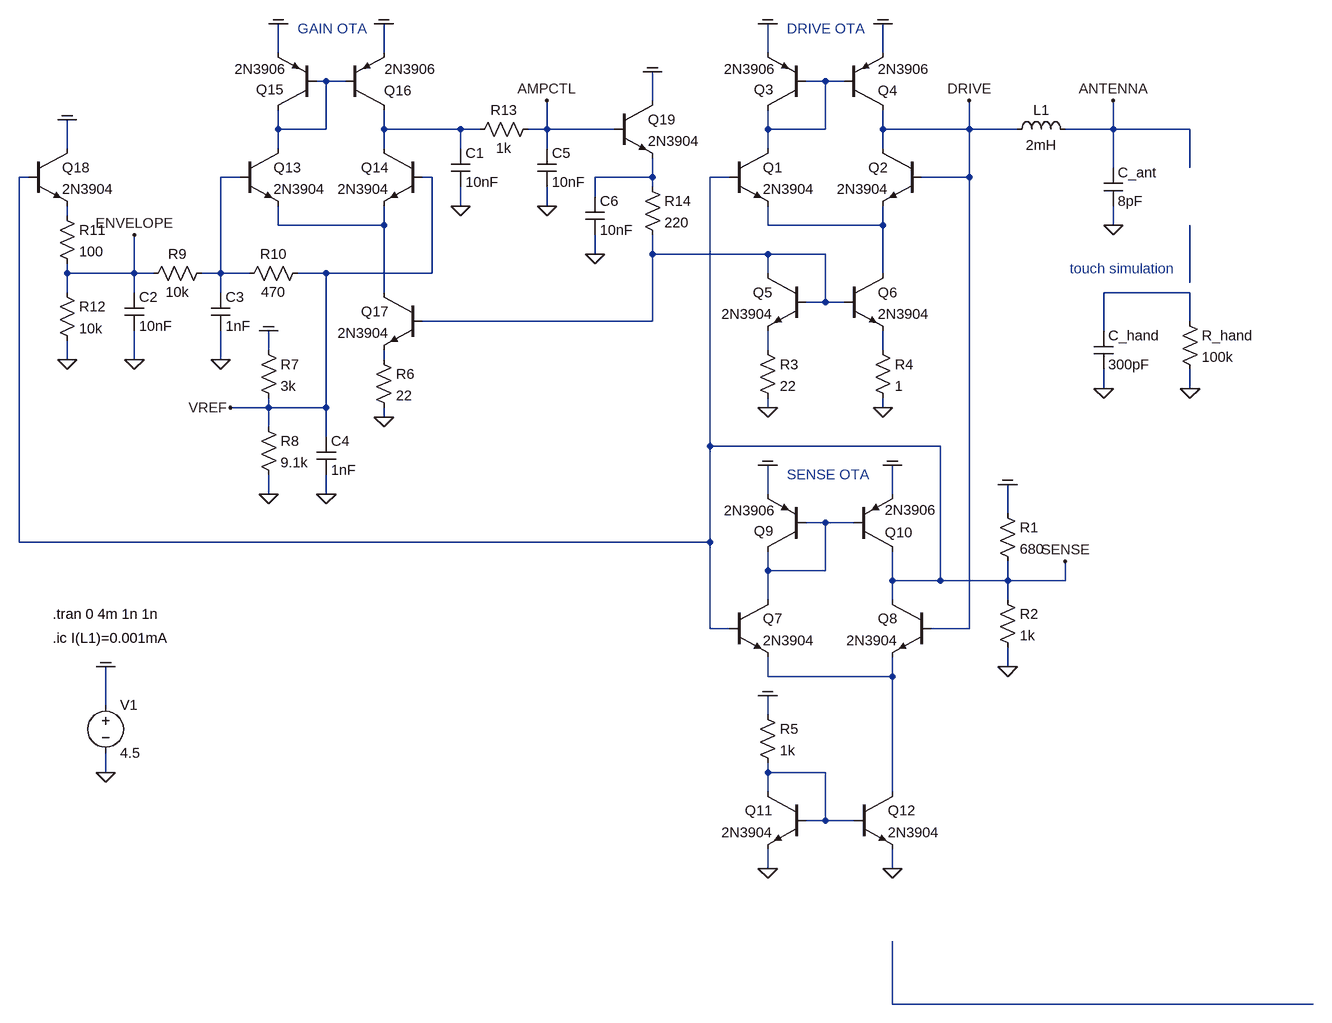
[diagram p0: schematic bjt_current_sensing_oscillator_ota_v10.asc]
bjt_current_sensing_oscillator_ota_v10.asc, the LTspice schematic file:
Version 4
SHEET 1 4648 6228
WIRE 48 1552 48 1504
WIRE 224 1552 224 1504
WIRE 864 1552 864 1504
WIRE 1056 1552 1056 1504
WIRE 128 1600 112 1600
WIRE 160 1600 128 1600
WIRE 960 1600 928 1600
WIRE 992 1600 960 1600
WIRE 672 1632 672 1584
WIRE 48 1680 48 1648
WIRE 128 1680 128 1600
WIRE 128 1680 48 1680
WIRE 224 1680 224 1648
WIRE 352 1680 224 1680
WIRE 384 1680 352 1680
WIRE 496 1680 496 1632
WIRE 496 1680 464 1680
WIRE 608 1680 496 1680
WIRE 864 1680 864 1648
WIRE 960 1680 960 1600
WIRE 960 1680 864 1680
WIRE 1056 1680 1056 1648
WIRE 1200 1680 1200 1632
WIRE 1200 1680 1056 1680
WIRE 1280 1680 1200 1680
WIRE 1440 1680 1440 1632
WIRE 1440 1680 1360 1680
WIRE 1568 1680 1440 1680
WIRE -304 1712 -304 1664
WIRE 48 1712 48 1680
WIRE 224 1712 224 1680
WIRE 352 1712 352 1680
WIRE 496 1712 496 1680
WIRE 864 1712 864 1680
WIRE 1056 1712 1056 1680
WIRE 1440 1744 1440 1680
WIRE 1568 1744 1568 1680
WIRE -368 1760 -384 1760
WIRE -16 1760 -48 1760
WIRE 304 1760 288 1760
WIRE 672 1760 672 1728
WIRE 672 1760 576 1760
WIRE 800 1760 768 1760
WIRE 1200 1760 1200 1680
WIRE 1200 1760 1120 1760
WIRE 672 1776 672 1760
WIRE 576 1792 576 1760
WIRE 352 1808 352 1776
WIRE 496 1808 496 1776
WIRE -304 1824 -304 1808
WIRE 48 1840 48 1808
WIRE 224 1840 224 1808
WIRE 224 1840 48 1840
WIRE 864 1840 864 1808
WIRE 1056 1840 1056 1808
WIRE 1056 1840 864 1840
WIRE 1440 1840 1440 1808
WIRE 576 1888 576 1856
WIRE 672 1888 672 1856
WIRE 864 1888 672 1888
WIRE 960 1888 864 1888
WIRE -304 1920 -304 1904
WIRE -192 1920 -192 1856
WIRE -192 1920 -304 1920
WIRE -160 1920 -192 1920
WIRE -48 1920 -48 1760
WIRE -48 1920 -80 1920
WIRE 0 1920 -48 1920
WIRE 128 1920 80 1920
WIRE 304 1920 304 1760
WIRE 304 1920 128 1920
WIRE 864 1920 864 1888
WIRE 1056 1920 1056 1840
WIRE 1568 1936 1568 1840
WIRE -304 1952 -304 1920
WIRE -192 1952 -192 1920
WIRE -48 1952 -48 1920
WIRE 224 1952 224 1840
WIRE 1568 1952 1424 1952
WIRE 960 1968 960 1888
WIRE 960 1968 928 1968
WIRE 992 1968 960 1968
WIRE 672 2000 672 1888
WIRE 672 2000 288 2000
WIRE 1568 2000 1568 1952
WIRE 1424 2016 1424 1952
WIRE 32 2048 32 2016
WIRE 864 2048 864 2016
WIRE 1056 2048 1056 2016
WIRE -304 2064 -304 2032
WIRE -192 2064 -192 2016
WIRE -48 2064 -48 2016
WIRE 224 2064 224 2048
WIRE 1424 2112 1424 2080
WIRE 1568 2112 1568 2080
WIRE 32 2144 32 2128
WIRE 32 2144 -32 2144
WIRE 128 2144 128 1920
WIRE 128 2144 32 2144
WIRE 864 2144 864 2128
WIRE 1056 2144 1056 2128
WIRE 224 2160 224 2144
WIRE 32 2176 32 2144
WIRE 128 2192 128 2144
WIRE 768 2208 768 1760
WIRE 1152 2208 768 2208
WIRE 32 2288 32 2256
WIRE 128 2288 128 2256
WIRE 864 2288 864 2240
WIRE 1072 2288 1072 2240
WIRE 1264 2320 1264 2272
WIRE 960 2336 928 2336
WIRE 1008 2336 960 2336
WIRE -384 2368 -384 1760
WIRE 768 2368 768 2208
WIRE 768 2368 -384 2368
WIRE 864 2416 864 2384
WIRE 960 2416 960 2336
WIRE 960 2416 864 2416
WIRE 1072 2432 1072 2384
WIRE 1152 2432 1152 2208
WIRE 1152 2432 1072 2432
WIRE 1264 2432 1264 2400
WIRE 1264 2432 1152 2432
WIRE 1360 2432 1360 2400
WIRE 1360 2432 1264 2432
WIRE 864 2464 864 2416
WIRE 1072 2464 1072 2432
WIRE 1264 2464 1264 2432
WIRE 768 2512 768 2368
WIRE 800 2512 768 2512
WIRE 1200 2512 1200 1760
WIRE 1200 2512 1136 2512
WIRE 1264 2576 1264 2544
WIRE 864 2592 864 2560
WIRE 1072 2592 1072 2560
WIRE 1072 2592 864 2592
WIRE -240 2640 -240 2576
WIRE 864 2656 864 2624
WIRE -240 2752 -240 2720
WIRE 864 2752 864 2736
WIRE 960 2752 864 2752
WIRE 864 2784 864 2752
WIRE 1072 2784 1072 2592
WIRE 960 2832 960 2752
WIRE 960 2832 928 2832
WIRE 1008 2832 960 2832
WIRE 864 2912 864 2880
WIRE 1072 2912 1072 2880
WIRE 1072 6224 1072 5696
WIRE 2080 6224 1072 6224
FLAG 1440 1840 0
FLAG 1440 1632 ANTENNA
FLAG -240 2752 0
FLAG -240 2576 COM
FLAG 1424 2112 0
FLAG 1568 2112 0
FLAG 1072 2912 0
FLAG 864 2624 COM
FLAG 1264 2576 0
FLAG 1264 2272 COM
FLAG 1360 2400 SENSE
FLAG 864 2144 0
FLAG 1056 2144 0
FLAG 672 1584 COM
FLAG 864 2912 0
FLAG 496 1632 AMPCTL
FLAG 1200 1632 DRIVE
FLAG 224 2160 0
FLAG 496 1808 0
FLAG -304 1664 COM
FLAG -192 2064 0
FLAG -304 2064 0
FLAG 352 1808 0
FLAG 576 1888 0
FLAG -48 2064 0
FLAG 32 2288 0
FLAG 32 2016 COM
FLAG 128 2288 0
FLAG 48 1504 COM
FLAG 224 1504 COM
FLAG 864 1504 COM
FLAG 1056 1504 COM
FLAG 864 2240 COM
FLAG 1072 2240 COM
FLAG -192 1856 ENVELOPE
FLAG -32 2144 VREF
SYMBOL ind 1264 1696 R270
WINDOW 0 32 56 VTop 2
WINDOW 3 5 56 VBottom 2
SYMATTR InstName L1
SYMATTR Value 2mH
SYMATTR SpiceLine Ipk=100m Rser=20 Rpar=10Meg Cpar=1pF
SYMBOL cap 1424 1744 R0
SYMATTR InstName C_ant
SYMATTR Value 8pF
SYMBOL voltage -240 2624 R0
WINDOW 123 0 0 Left 0
WINDOW 39 0 0 Left 0
SYMATTR InstName V1
SYMATTR Value 4.5
SYMBOL cap 1408 2016 R0
SYMATTR InstName C_hand
SYMATTR Value 300pF
SYMBOL res 1552 1984 R0
WINDOW 0 36 40 Left 2
WINDOW 3 36 76 Left 2
SYMATTR InstName R_hand
SYMATTR Value 100k
SYMBOL npn 1120 1712 M0
SYMATTR InstName Q2
SYMATTR Value 2N3904
SYMBOL npn 800 1712 R0
SYMATTR InstName Q1
SYMATTR Value 2N3904
SYMBOL pnp 992 1648 M180
SYMATTR InstName Q4
SYMATTR Value 2N3906
SYMBOL pnp 928 1648 R180
WINDOW 0 55 34 Left 2
WINDOW 3 52 68 Left 2
SYMATTR InstName Q3
SYMATTR Value 2N3906
SYMBOL npn 1136 2464 M0
SYMATTR InstName Q8
SYMATTR Value 2N3904
SYMBOL npn 800 2464 R0
SYMATTR InstName Q7
SYMATTR Value 2N3904
SYMBOL pnp 1008 2384 M180
WINDOW 0 51 32 Left 2
WINDOW 3 51 69 Left 2
SYMATTR InstName Q10
SYMATTR Value 2N3906
SYMBOL pnp 928 2384 R180
WINDOW 0 55 34 Left 2
WINDOW 3 52 68 Left 2
SYMATTR InstName Q9
SYMATTR Value 2N3906
SYMBOL npn 1008 2784 R0
SYMATTR InstName Q12
SYMATTR Value 2N3904
SYMBOL res 848 2640 R0
WINDOW 0 36 40 Left 2
WINDOW 3 36 76 Left 2
SYMATTR InstName R5
SYMATTR Value 1k
SYMBOL npn 928 2784 M0
SYMATTR InstName Q11
SYMATTR Value 2N3904
SYMBOL res 1248 2448 R0
WINDOW 0 36 40 Left 2
WINDOW 3 36 76 Left 2
SYMATTR InstName R2
SYMATTR Value 1k
SYMBOL res 1248 2304 R0
WINDOW 0 36 40 Left 2
WINDOW 3 36 76 Left 2
SYMATTR InstName R1
SYMATTR Value 680
SYMBOL res 656 1760 R0
WINDOW 0 36 40 Left 2
WINDOW 3 36 76 Left 2
SYMATTR InstName R14
SYMATTR Value 220
SYMBOL npn 928 1920 M0
SYMATTR InstName Q5
SYMATTR Value 2N3904
SYMBOL npn 992 1920 R0
SYMATTR InstName Q6
SYMATTR Value 2N3904
SYMBOL res 848 2032 R0
WINDOW 0 36 40 Left 2
WINDOW 3 36 76 Left 2
SYMATTR InstName R3
SYMATTR Value 22
SYMBOL res 1040 2032 R0
WINDOW 0 36 40 Left 2
WINDOW 3 36 76 Left 2
SYMATTR InstName R4
SYMATTR Value 1
SYMBOL npn 608 1632 R0
SYMATTR InstName Q19
SYMATTR Value 2N3904
SYMBOL npn 288 1712 M0
SYMATTR InstName Q14
SYMATTR Value 2N3904
SYMBOL npn -16 1712 R0
SYMATTR InstName Q13
SYMATTR Value 2N3904
SYMBOL pnp 160 1648 M180
WINDOW 0 64 32 Left 2
WINDOW 3 65 68 Left 2
SYMATTR InstName Q16
SYMATTR Value 2N3906
SYMBOL pnp 112 1648 R180
WINDOW 0 55 34 Left 2
WINDOW 3 52 68 Left 2
SYMATTR InstName Q15
SYMATTR Value 2N3906
SYMBOL res 208 2048 R0
WINDOW 0 36 40 Left 2
WINDOW 3 36 76 Left 2
SYMATTR InstName R6
SYMATTR Value 22
SYMBOL res 480 1664 R90
WINDOW 0 0 56 VBottom 2
WINDOW 3 32 56 VTop 2
SYMATTR InstName R13
SYMATTR Value 1k
SYMBOL cap 480 1712 R0
SYMATTR InstName C5
SYMATTR Value 10nF
SYMBOL npn -368 1712 R0
SYMATTR InstName Q18
SYMATTR Value 2N3904
SYMBOL res -320 1808 R0
WINDOW 0 36 40 Left 2
WINDOW 3 36 76 Left 2
SYMATTR InstName R11
SYMATTR Value 100
SYMBOL cap -208 1952 R0
SYMATTR InstName C2
SYMATTR Value 10nF
SYMBOL res -64 1904 R90
WINDOW 0 0 56 VBottom 2
WINDOW 3 32 56 VTop 2
SYMATTR InstName R9
SYMATTR Value 10k
SYMBOL res 96 1904 R90
WINDOW 0 0 56 VBottom 2
WINDOW 3 32 56 VTop 2
SYMATTR InstName R10
SYMATTR Value 470
SYMBOL res -320 1936 R0
WINDOW 0 36 40 Left 2
WINDOW 3 36 76 Left 2
SYMATTR InstName R12
SYMATTR Value 10k
SYMBOL cap 336 1712 R0
SYMATTR InstName C1
SYMATTR Value 10nF
SYMBOL cap 560 1792 R0
SYMATTR InstName C6
SYMATTR Value 10nF
SYMBOL cap -64 1952 R0
SYMATTR InstName C3
SYMATTR Value 1nF
SYMBOL res 16 2160 R0
WINDOW 0 36 40 Left 2
WINDOW 3 36 76 Left 2
SYMATTR InstName R8
SYMATTR Value 9.1k
SYMBOL res 16 2032 R0
WINDOW 0 36 40 Left 2
WINDOW 3 36 76 Left 2
SYMATTR InstName R7
SYMATTR Value 3k
SYMBOL cap 112 2192 R0
SYMATTR InstName C4
SYMATTR Value 1nF
SYMBOL npn 288 1952 M0
SYMATTR InstName Q17
SYMATTR Value 2N3904
TEXT -328 2488 Left 2 !.tran 0 4m 1n 1n
TEXT -328 2528 Left 2 !.ic I(L1)=0.001mA
TEXT 1368 1912 Left 2 ;touch simulation
TEXT 896 1512 Left 2 ;DRIVE OTA
TEXT 896 2256 Left 2 ;SENSE OTA
TEXT 80 1512 Left 2 ;GAIN OTA

The netlist it stands for:
* bjt_current_sensing_oscillator_ota_v10.asc
L1 DRIVE ANTENNA 2mH Ipk=100m Rser=20 Rpar=10Meg Cpar=1pF
C_ant ANTENNA 0 8pF
V1 COM 0 4.5
C_hand N011 0 300pF
R_hand N011 0 100k
Q2 DRIVE DRIVE N008 0 2N3904
Q1 N002 SENSE N008 0 2N3904
Q4 DRIVE N002 COM 0 2N3906
Q3 N002 N002 COM 0 2N3906
Q8 SENSE DRIVE N016 0 2N3904
Q7 N015 SENSE N016 0 2N3904
Q10 SENSE N015 COM 0 2N3906
Q9 N015 N015 COM 0 2N3906
Q12 N016 N017 0 0 2N3904
R5 COM N017 1k
Q11 N017 N017 0 0 2N3904
R2 SENSE 0 1k
R1 COM SENSE 680
R14 N005 N009 220
Q5 N009 N009 N012 0 2N3904
Q6 N008 N009 N013 0 2N3904
R3 N012 0 22
R4 N013 0 1
Q19 COM AMPCTL N005 0 2N3904
Q14 N003 VREF N007 0 2N3904
Q13 N001 N004 N007 0 2N3904
Q16 N003 N001 COM 0 2N3906
Q15 N001 N001 COM 0 2N3906
R6 N014 0 22
R13 AMPCTL N003 1k
C5 AMPCTL 0 10nF
Q18 COM SENSE N006 0 2N3904
R11 N006 ENVELOPE 100
C2 ENVELOPE 0 10nF
R9 N004 ENVELOPE 10k
R10 VREF N004 470
R12 ENVELOPE 0 10k
C1 N003 0 10nF
C6 N005 0 10nF
C3 N004 0 1nF
R8 VREF 0 9.1k
R7 COM VREF 3k
C4 VREF 0 1nF
Q17 N007 N009 N014 0 2N3904
.model NPN NPN
.model PNP PNP
.lib standard.bjt
.tran 0 4m 1n 1n
.ic I(L1)=0.001mA
* touch simulation
* DRIVE OTA
* SENSE OTA
* GAIN OTA
.backanno
.end